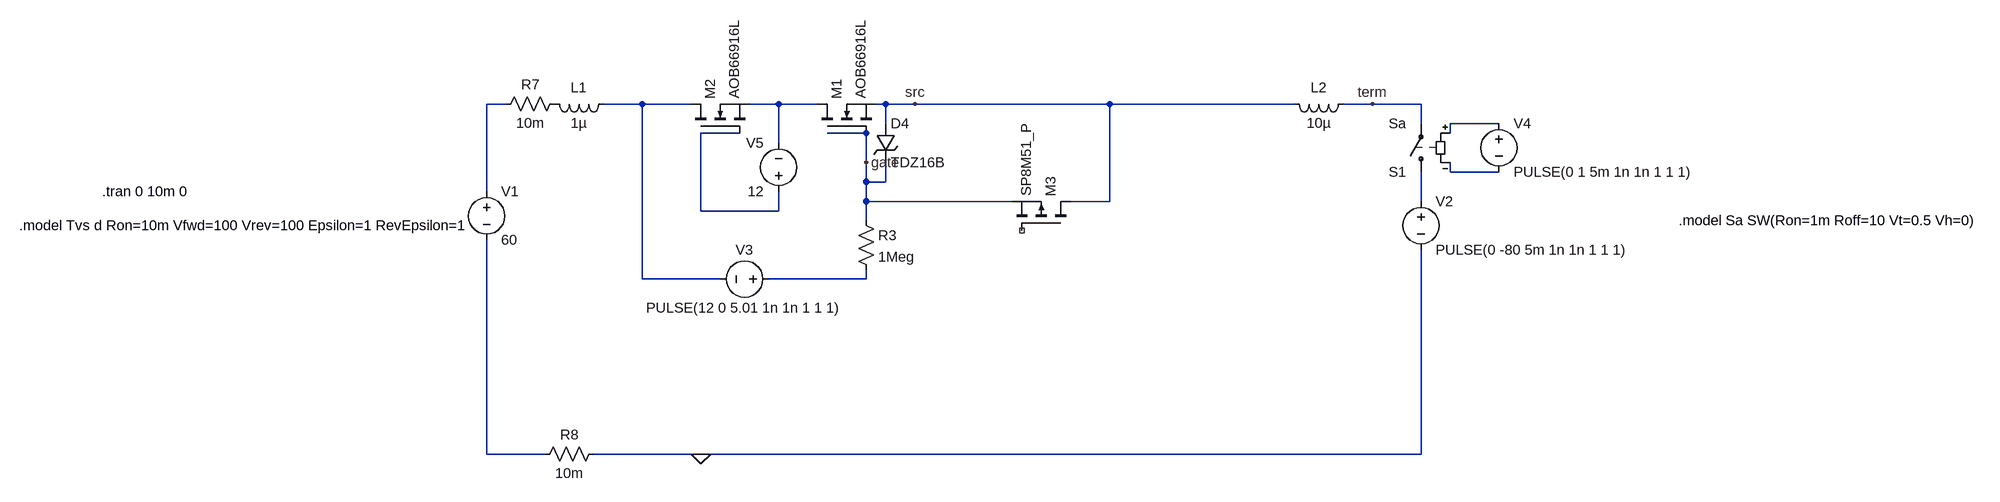
[diagram p0: schematic FET Driver.asc]
FET Driver.asc, the LTspice schematic file:
Version 4
SHEET 1 1884 732
WIRE -432 32 -464 32
WIRE -208 32 -272 32
WIRE -128 32 -208 32
WIRE 16 32 -32 32
WIRE 80 32 16 32
WIRE 192 32 176 32
WIRE 240 32 192 32
WIRE 560 32 240 32
WIRE 864 32 560 32
WIRE 992 32 944 32
WIRE 1072 32 992 32
WIRE 192 64 192 32
WIRE 1072 64 1072 32
WIRE 1200 64 1120 64
WIRE -48 80 -112 80
WIRE 160 80 96 80
WIRE 1120 80 1120 64
WIRE 16 96 16 32
WIRE 160 128 160 80
WIRE 1120 144 1120 128
WIRE 1200 144 1120 144
WIRE 160 160 160 128
WIRE 192 160 192 128
WIRE 192 160 160 160
WIRE -464 176 -464 32
WIRE 160 192 160 160
WIRE 400 192 160 192
WIRE 560 192 560 32
WIRE 560 192 496 192
WIRE 1072 192 1072 144
WIRE -112 208 -112 80
WIRE 16 208 16 176
WIRE 16 208 -112 208
WIRE 160 224 160 192
WIRE -208 320 -208 32
WIRE -80 320 -208 320
WIRE 160 320 160 304
WIRE 160 320 0 320
WIRE -464 608 -464 256
WIRE -368 608 -464 608
WIRE -112 608 -288 608
WIRE 1072 608 1072 272
WIRE 1072 608 -112 608
FLAG -112 608 0
FLAG 240 32 src
FLAG 160 128 gate
FLAG 992 32 term
SYMBOL nmos 80 80 R270
SYMATTR InstName M1
SYMATTR Value AOB66916L
SYMBOL nmos -128 80 R270
SYMATTR InstName M2
SYMATTR Value AOB66916L
SYMBOL voltage -464 160 R0
WINDOW 123 0 0 Left 0
WINDOW 39 0 0 Left 0
SYMATTR InstName V1
SYMATTR Value 60
SYMBOL voltage 1072 176 R0
WINDOW 123 0 0 Left 0
WINDOW 39 0 0 Left 0
SYMATTR InstName V2
SYMATTR Value PULSE(0 -80 5m 1n 1n 1 1 1)
SYMBOL sw 1072 160 R180
SYMATTR InstName S1
SYMATTR Value Sa
SYMBOL voltage 1200 48 R0
WINDOW 123 0 0 Left 0
WINDOW 39 0 0 Left 0
SYMATTR InstName V4
SYMATTR Value PULSE(0 1 5m 1n 1n 1 1 1)
SYMBOL voltage 16 192 R180
WINDOW 0 24 96 Left 2
WINDOW 3 24 16 Left 2
WINDOW 123 0 0 Left 0
WINDOW 39 0 0 Left 0
SYMATTR InstName V5
SYMATTR Value 12
SYMBOL res 144 208 R0
SYMATTR InstName R3
SYMATTR Value 1Meg
SYMBOL zener 176 64 R0
SYMATTR InstName D4
SYMATTR Value TDZ16B
SYMATTR Description Diode
SYMATTR Type diode
SYMBOL res -336 16 R90
WINDOW 0 0 56 VBottom 2
WINDOW 3 32 56 VTop 2
SYMATTR InstName R7
SYMATTR Value 10m
SYMBOL ind 960 16 R90
WINDOW 0 5 56 VBottom 2
WINDOW 3 32 56 VTop 2
SYMATTR InstName L2
SYMATTR Value 10µ
SYMBOL ind -256 16 R90
WINDOW 0 5 56 VBottom 2
WINDOW 3 32 56 VTop 2
SYMATTR InstName L1
SYMATTR Value 1µ
SYMBOL voltage 16 320 R90
WINDOW 0 -32 56 VBottom 2
WINDOW 3 32 56 VTop 2
WINDOW 123 0 0 Left 0
WINDOW 39 0 0 Left 0
SYMATTR InstName V3
SYMATTR Value PULSE(12 0 5.01 1n 1n 1 1 1)
SYMBOL res -272 592 R90
WINDOW 0 0 56 VBottom 2
WINDOW 3 32 56 VTop 2
SYMATTR InstName R8
SYMATTR Value 10m
SYMBOL pmos 496 240 M270
SYMATTR InstName M3
SYMATTR Value SP8M51_P
TEXT -1096 176 Left 2 !.tran 0 10m 0
TEXT 1496 224 Left 2 !.model Sa SW(Ron=1m Roff=10 Vt=0.5 Vh=0)
TEXT -1232 232 Left 2 !.model Tvs d Ron=10m Vfwd=100 Vrev=100 Epsilon=1 RevEpsilon=1

The netlist it stands for:
* FET Driver.asc
M1 N003 gate src src AOB66916L
M2 N002 N005 N003 N003 AOB66916L
V1 N001 N009 60
V2 N007 0 PULSE(0 -80 5m 1n 1n 1 1 1)
S1 N007 term N004 N006 Sa
V4 N004 N006 PULSE(0 1 5m 1n 1n 1 1 1)
V5 N005 N003 12
R3 gate N008 1Meg
D4 src gate TDZ16B
R7 P001 N001 10m
L2 term src 10µ
L1 N002 P001 1µ
V3 N008 N002 PULSE(12 0 5.01 1n 1n 1 1 1)
R8 0 N009 10m
M3 src NC_01 gate gate SP8M51_P
.model D D
.lib standard.dio
.model NMOS NMOS
.model PMOS PMOS
.lib standard.mos
.tran 0 10m 0
.model Sa SW(Ron=1m Roff=10 Vt=0.5 Vh=0)
.model Tvs d Ron=10m Vfwd=100 Vrev=100 Epsilon=1 RevEpsilon=1
.backanno
.end